# Altium schematic sheet Sheet1.SchDoc: *Wireless
size A4
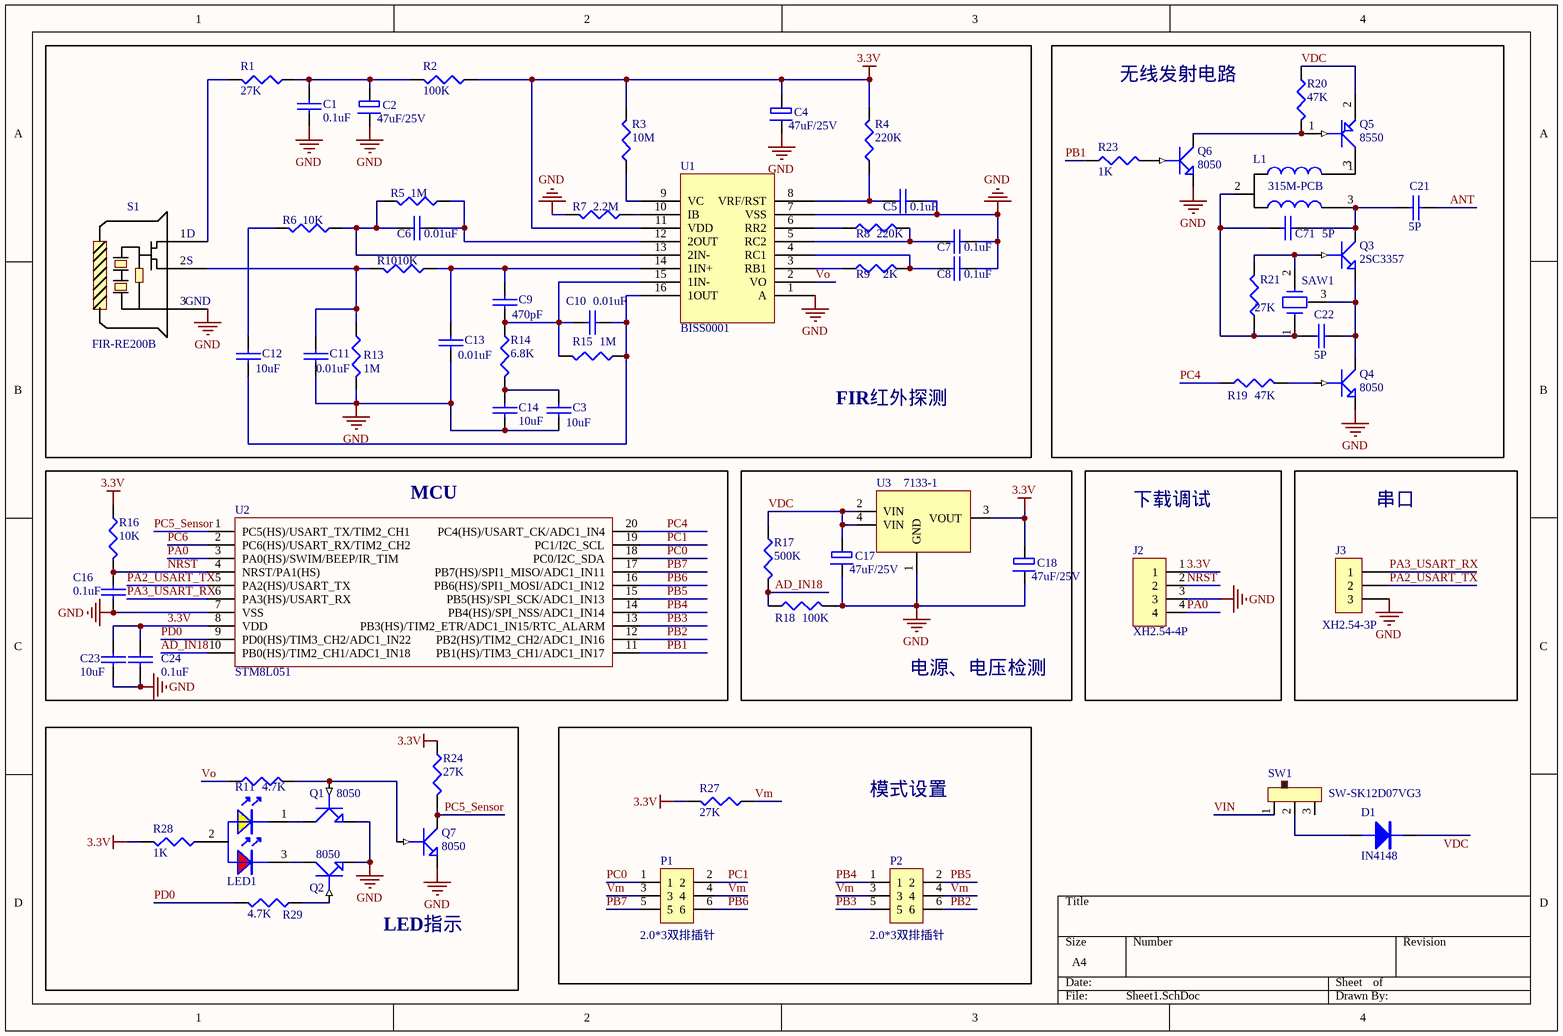
[diagram p0: Sheet1.SchDoc]

## Parts
C1  0.1uF  [0603]
C2  47uF/25V  [RB2.54 5*11]
C3  10uF  [0805]
C4  47uF/25V  [RB2.54 5*11]
C5  0.1uF  [0603]
C6  0.01uF  [0603]
C7  0.1uF  [0603]
C8  0.1uF  [0603]
C9  470pF  [0603]
C10  0.01uF  [0603]
C11  0.01uF  [0603]
C12  10uF  [0805]
C13  0.01uF  [0603]
C14  10uF  [0805]
C16  0.1uF  [0603]
C17  47uF/25V  [RB2.54 5*11]
C18  47uF/25V  [RB2.54 5*11]
C21  5P  [0603]
C22  5P  [0603]
C23  10uF  [0805]
C24  0.1uF  [0603]
C71  5P  [0603]
D1  IN4148  [SOD-123]
J2  XH2.54-4P  [2.54-4]
J3  XH2.54-3P  [2.54-3]
L1  315M-PCB  [315M-PCB]
LED1  红黄LED  [LED-K]  (value not drawn)
P1  2.0*3双排插针  [2.0*3*2]
P2  2.0*3双排插针  [2.0*3*2]
Q1  8050  [SOT-23]
Q2  8050  [SOT-23]
Q3  2SC3357  [SOT-23]
Q4  8050  [SOT-23]
Q5  8550  [SOT-23]
Q6  8050  [SOT-23]
Q7  8050  [SOT-23]
R1  27K  [0603]
R2  100K  [0603]
R3  10M  [0603]
R4  220K  [0603]
R5  1M  [0603]
R6  10K  [0603]
R7  2.2M  [0603]
R8  220K  [0603]
R9  2K  [0603]
R10  10K  [0603]
R11  4.7K  [0603]
R13  1M  [0603]
R14  6.8K  [0603]
R15  1M  [0603]
R16  10K  [0603]
R17  500K  [0603]
R18  100K  [0603]
R19  47K  [0603]
R20  47K  [0603]
R21  27K  [0603]
R23  1K  [0603]
R24  27K  [0603]
R27  27K  [0603]
R28  1K  [0603]
R29  4.7K  [0603]
S1  FIR-RE200B  [TO-39]
SAW1  CRYSTAL(表面接地)  [TO-39]  (value not drawn)
SW1  SW-SK12D07VG3  [SW-SK12D07VG3]
U1  BISS0001  [SO-16]
U2  STM8L051  [TSSOP20]
U3  7133-1  [SOT-89]

## Blocks framed on the sheet
FIR红外探测: C1-C14 R1-R10 R13-R15 S1 U1
无线发射电路: C21 C22 C71 L1 Q3-Q6 R19-R21 R23 SAW1
MCU: C16 C23 C24 R16 U2
电源、电压检测: C17 C18 R17 R18 U3
下载调试: J2
串口: J3
LED指示: LED1 Q1 Q2 Q7 R11 R24 R28 R29
模式设置: P1 P2 R27

## Nets
3.3V: C4.1 C18.1 C23.2 C24.2 J2.1 R2.1 R3.2 R4.2 R16.1 R24.1 R27.2 R28.2 U1.11(VDD) U2.8(VDD) U3.3(VOUT)
GND: C1.1 C2.2 C3.1 C4.2 C5.2 C7.2 C8.2 C11.2 C13.2 C14.1 C16.1 C17.2 C18.2 C23.1 C24.1 J2.3 J3.3 Q1.2(E) Q2.2(E) Q4.2(E) Q6.2(E) Q7.2(E) R7.2 R13.2 R18.2 S1.3 U1.1(A) U1.7(VSS) U2.7(VSS) U3.1(GND)
AD_IN18: R17.2 R18.1 U2.10(PB0(HS)/TIM2_CH1/ADC1_IN18)
ANT: C21.2
NRST: C16.2 J2.2 R16.2 U2.4(NRST/PA1(HS))
PA0: J2.4 U2.3(PA0(HS)/SWIM/BEEP/IR_TIM)
PA2_USART_TX: J3.2 U2.5(PA2(HS)/USART_TX)
PA3_USART_RX: J3.1 U2.6(PA3(HS)/USART_RX)
PB1: R23.1 U2.11(PB1(HS)/TIM3_CH1/ADC1_IN17)
PB2: P2.6 U2.12(PB2(HS)/TIM2_CH2/ADC1_IN16)
PB3: P2.5 U2.13(PB3(HS)/TIM2_ETR/ADC1_IN15/RTC_ALARM)
PB4: P2.1 U2.14(PB4(HS)/SPI_NSS/ADC1_IN14)
PB5: P2.2 U2.15(PB5(HS)/SPI_SCK/ADC1_IN13)
PB6: P1.6 U2.16(PB6(HS)/SPI1_MOSI/ADC1_IN12)
PB7: P1.5 U2.17(PB7(HS)/SPI1_MISO/ADC1_IN11)
PC0: P1.1 U2.18(PC0/I2C_SDA)
PC1: P1.2 U2.19(PC1/I2C_SCL)
PC4: R19.1 U2.20(PC4(HS)/USART_CK/ADC1_IN4)
PC5_Sensor: Q7.3(C) R24.2 U2.1(PC5(HS)/USART_TX/TIM2_CH1)
PC6: U2.2(PC6(HS)/USART_RX/TIM2_CH2)
PD0: R29.2 U2.9(PD0(HS)/TIM3_CH2/ADC1_IN22)
VDC: C17.1 D1.2(K) Q5.2(E) R17.1 R20.1 U3.2(VIN) U3.4(VIN)
VIN: SW1.1
Vm: P1.3 P1.4 P2.3 P2.4 R27.1
Vo: R11.1 U1.2(VO)
NetC1_2: C1.2 C2.1 R1.1 R2.2
NetC3_2: C3.2 C14.2 R14.2
NetC5_1: C5.1 R4.1 U1.8(VRF/RST)
NetC6_1: C6.1 R5.1 U1.12(2OUT)
NetC6_2: C6.2 R5.2 R6.1 U1.13(2IN-)
NetC7_1: C7.1 R8.2 U1.5(RC2)
NetC8_1: C8.1 R9.2 U1.4(RC1)
NetC9_1: C9.1 C13.1 R10.1 U1.14(1IN+)
NetC9_2: C9.2 C10.2 R14.1 R15.2 U1.15(1IN-)
NetC10_1: C10.1 C12.2 R15.1 U1.16(1OUT)
NetC11_1: C11.1 R10.2 R13.1 S1.2
NetC12_1: C12.1 R6.2
NetC21_1: C21.1 C71.2 L1.3(L3) Q3.3(C)
NetC22_1: C22.1 Q3.2(E) Q4.3(C) SAW1.3(GND)
NetC22_2: C22.2 C71.1 L1.2(L2) R21.1 SAW1.1
NetD1_1: D1.1(A) SW1.2
NetL1_1: L1.1(L1) Q5.3(C)
NetLED1_1: LED1.1(Y) Q1.3(C)
NetLED1_2: LED1.2(A) R28.1
NetLED1_3: LED1.3(R) Q2.3(C)
NetQ1_1: Q1.1(B) Q7.1(B) R11.2
NetQ2_1: Q2.1(B) R29.1
NetQ3_1: Q3.1(B) R21.2 SAW1.2
NetQ4_1: Q4.1(B) R19.2
NetQ5_1: Q5.1(B) Q6.3(C) R20.2
NetQ6_1: Q6.1(B) R23.2
NetR1_2: R1.2 S1.1
NetR3_1: R3.1 U1.9(VC)
NetR7_1: R7.1 U1.10(IB)
NetR8_1: R8.1 U1.6(RR2)
NetR9_1: R9.1 U1.3(RB1)

Not connected (* = marked no-connect by the designer): SW1 3(7)

## Notes on the sheet
- (in symbol FIR-RE200B) D; S; GND

## Library data of the parts
C1 C5-C11 C13 C16 C24 = CAP-0603: 0603陶瓷贴片电容
C2 C4 C17 C18 = 47uF/25V: 铝电解电容
C3 C12 C14 C23 = CAP-0805: 0805陶瓷贴片电容
C21 C22 C71 = CAP
D1 = IN4148: IN4148开关二极管
J2 = XH2.54-4P: XH2.54-4P 白色插座
J3 = XH2.54-3P: XH2.54-3P 白色母座
L1 = 315M-PCB: 板载PCB天线
LED1 = LED2: 3mm共阳极 双色红黄LED
P1 P2 = 2.0*3双排插针: 2.0mm*3   双排插针
Q1 Q2 Q4 Q6 Q7 = 8050: 8050 NPN型三极管
Q3 = 2SC3357: 2SC3357 高频二极管
Q5 = 8550: 8550  PNP三极管
R1-R11 R13-R20 R23 R24 R27-R29 = RES-0603: 陶瓷贴片电阻0603封装
R21 = RES1
SAW1 = CRYSTAL(表面接地): R315A  声表
SW1 = SW-SK12D07VG3: SK12D07VG3
U2 = STM8L051: 单片机
U3 = 7133-1: 7133-1   3.3V  LDO电源芯片